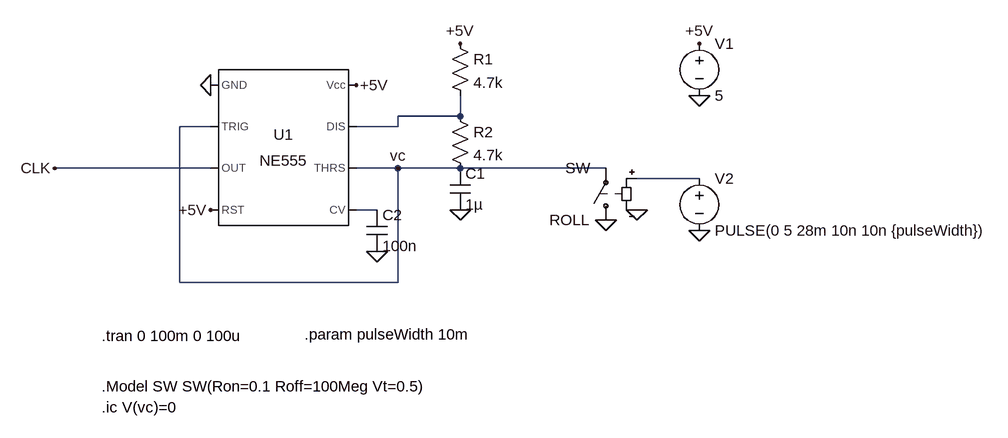
[diagram p0: schematic 555-clock-gen.asc]
555-clock-gen.asc, the LTspice schematic file:
Version 4
SHEET 1 2024 1580
WIRE 832 -480 832 -512
WIRE 832 -480 736 -480
WIRE 448 -464 400 -464
WIRE 736 -464 736 -480
WIRE 736 -464 672 -464
WIRE 448 -400 208 -400
WIRE 736 -400 672 -400
WIRE 832 -400 736 -400
WIRE 1056 -400 832 -400
WIRE 1200 -384 1104 -384
WIRE 704 -336 672 -336
WIRE 400 -224 400 -464
WIRE 736 -224 736 -400
WIRE 736 -224 400 -224
FLAG 1200 -512 0
FLAG 1200 -592 +5V
FLAG 672 -528 +5V
FLAG 832 -336 0
FLAG 832 -592 +5V
FLAG 448 -528 0
FLAG 1056 -320 0
FLAG 704 -272 0
FLAG 448 -336 +5V
FLAG 736 -400 vc
FLAG 1104 -336 0
FLAG 1200 -304 0
FLAG 208 -400 CLK
SYMBOL Misc\\NE555 560 -432 R0
SYMATTR InstName U1
SYMBOL voltage 1200 -608 R0
WINDOW 123 0 0 Left 0
WINDOW 39 0 0 Left 0
SYMATTR InstName V1
SYMATTR Value 5
SYMBOL res 816 -608 R0
SYMATTR InstName R1
SYMATTR Value 4.7k
SYMBOL cap 816 -400 R0
SYMATTR InstName C1
SYMATTR Value 1µ
SYMBOL res 816 -496 R0
SYMATTR InstName R2
SYMATTR Value 4.7k
SYMBOL cap 688 -336 R0
SYMATTR InstName C2
SYMATTR Value 100n
SYMBOL sw 1056 -304 R180
SYMATTR InstName ROLL
SYMBOL voltage 1200 -400 R0
WINDOW 123 0 0 Left 0
WINDOW 39 0 0 Left 0
SYMATTR InstName V2
SYMATTR Value PULSE(0 5 28m 10n 10n {pulseWidth})
TEXT 280 -142 Left 2 !.tran 0 100m 0 100u
TEXT 280 -32 Left 2 !.ic V(vc)=0
TEXT 280 -64 Left 2 !.Model SW SW(Ron=0.1 Roff=100Meg Vt=0.5)
TEXT 592 -144 Left 2 !.param pulseWidth 10m

The netlist it stands for:
* 555-clock-gen.asc
XU1 0 vc CLK +5V N003 vc N001 +5V NE555  ; pins GND TRIG OUT RST CV THRS DIS Vcc
V1 +5V 0 5
R1 +5V N001 4.7k
C1 vc 0 1µ
R2 N001 vc 4.7k
C2 N003 0 100n
S§ROLL 0 vc N002 0 SW
V2 N002 0 PULSE(0 5 28m 10n 10n {pulseWidth})
.tran 0 100m 0 100u
.ic V(vc)=0
.Model SW SW(Ron=0.1 Roff=100Meg Vt=0.5)
.param pulseWidth 10m
.lib NE555.sub
.backanno
.end